# EAGLE design PCB-BOTTOM_FINAL (EAGLE 7.6.0)
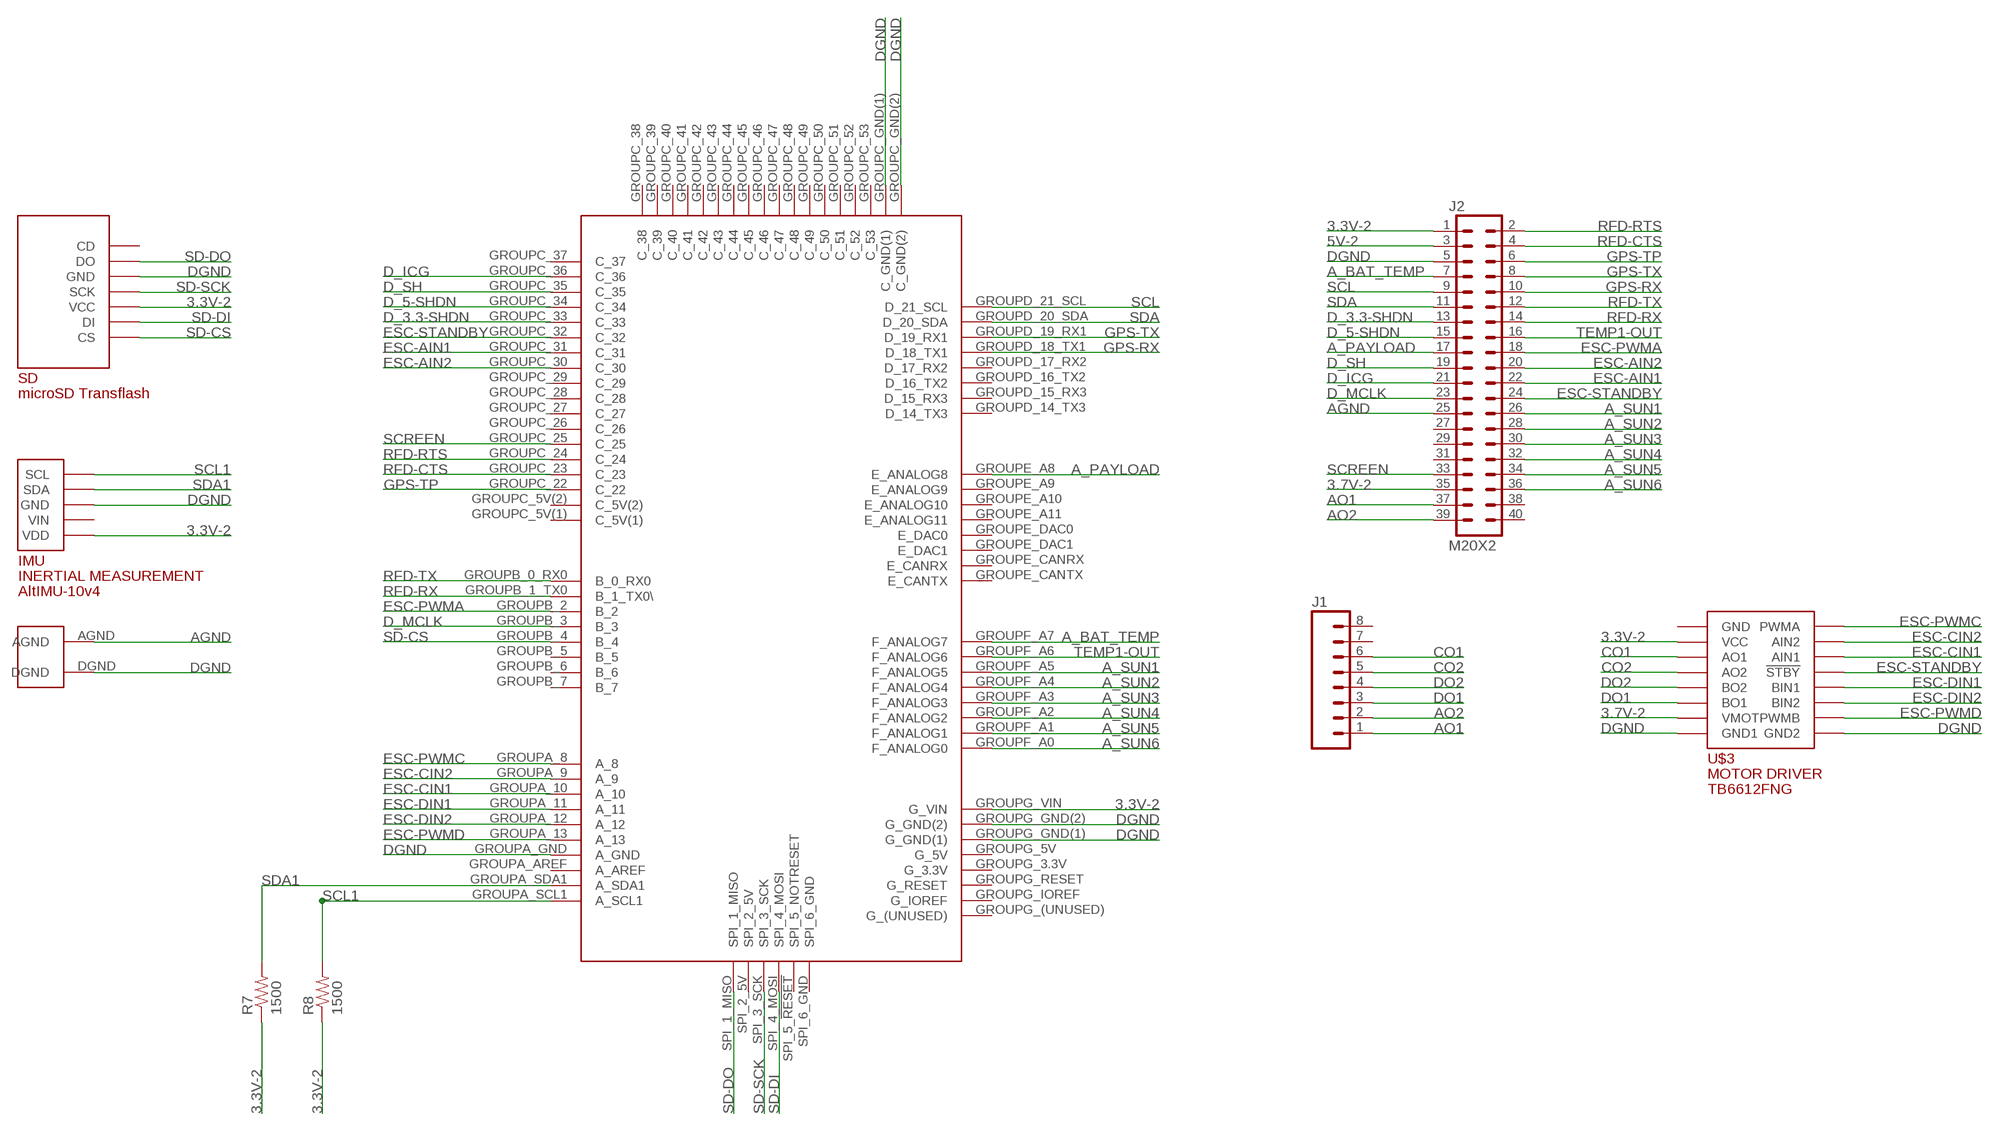
[diagram p0: schematic, sheet 1]

## Parts
IMU  ALTIMU-10V4DIP5  [DIP5]
J1  M08  [1X08_ROUND]
J2  M20X2  [2X20]
R7  1500  R-US_0204/5  [0204/5]
R8  1500  R-US_0204/5  [0204/5]
SD  DIP7DIP7  [DIP7]
U$1  IDUINO_DUE_PRO_DEVICE  [ADCH_ARDUINO-DUE-V03]
U$2  GROUNDPLANECONNECTIONS  [GND_PLANE_CONNECTION]
U$3  MOTOR_DRIVER_DEV  [MOTOR_DRIVER]

## Nets
3.3V-2: IMU.VDD J2.1 R7.1 R8.1 SD.VCC U$1.GROUPG_VIN(G_VIN) U$3.VCC
3.7V-2: J2.35 U$3.VMOT
5V-2: J2.3
A_BAT_TEMP: J2.7 U$1.GROUPF_A7(F_ANALOG7)
A_PAYLOAD: J2.17 U$1.GROUPE_A8(E_ANALOG8)
A_SUN1: J2.26 U$1.GROUPF_A5(F_ANALOG5)
A_SUN2: J2.28 U$1.GROUPF_A4(F_ANALOG4)
A_SUN3: J2.30 U$1.GROUPF_A3(F_ANALOG3)
A_SUN4: J2.32 U$1.GROUPF_A2(F_ANALOG2)
A_SUN5: J2.34 U$1.GROUPF_A1(F_ANALOG1)
A_SUN6: J2.36 U$1.GROUPF_A0(F_ANALOG0)
AGND: J2.25 U$2.AGND
AO1: J1.1 J2.37
AO2: J1.2 J2.39
CO1: J1.6 U$3.AO1
CO2: J1.5 U$3.AO2
D_3.3-SHDN: J2.13 U$1.GROUPC_33(C_33)
D_5-SHDN: J2.15 U$1.GROUPC_34(C_34)
D_ICG: J2.21 U$1.GROUPC_36(C_36)
D_MCLK: J2.23 U$1.GROUPB_3(B_3)
D_SH: J2.19 U$1.GROUPC_35(C_35)
DGND: IMU.GND J2.5 SD.GND U$1.GROUPA_GND(A_GND) U$1.GROUPC_GND(1)(C_GND(1)) U$1.GROUPC_GND(2)(C_GND(2)) U$1.GROUPG_GND(1)(G_GND(1)) U$1.GROUPG_GND(2)(G_GND(2)) U$2.DGND U$3.GND1 U$3.GND2
DO1: J1.3 U$3.BO1
DO2: J1.4 U$3.BO2
ESC-AIN1: J2.22 U$1.GROUPC_31(C_31)
ESC-AIN2: J2.20 U$1.GROUPC_30(C_30)
ESC-CIN1: U$1.GROUPA_10(A_10) U$3.AIN1
ESC-CIN2: U$1.GROUPA_9(A_9) U$3.AIN2
ESC-DIN1: U$1.GROUPA_11(A_11) U$3.BIN1
ESC-DIN2: U$1.GROUPA_12(A_12) U$3.BIN2
ESC-PWMA: J2.18 U$1.GROUPB_2(B_2)
ESC-PWMC: U$1.GROUPA_8(A_8) U$3.PWMA
ESC-PWMD: U$1.GROUPA_13(A_13) U$3.PWMB
ESC-STANDBY: J2.24 U$1.GROUPC_32(C_32) U$3.!STBY
GPS-RX: J2.10 U$1.GROUPD_18_TX1(D_18_TX1)
GPS-TP: J2.6 U$1.GROUPC_22(C_22)
GPS-TX: J2.8 U$1.GROUPD_19_RX1(D_19_RX1)
RFD-CTS: J2.4 U$1.GROUPC_23(C_23)
RFD-RTS: J2.2 U$1.GROUPC_24(C_24)
RFD-RX: J2.14 U$1.GROUPB_1_TX0(B_1_TX0\)
RFD-TX: J2.12 U$1.GROUPB_0_RX0(B_0_RX0)
SCL: J2.9 U$1.GROUPD_21_SCL(D_21_SCL)
SCL1: IMU.SCL R8.2 U$1.GROUPA_SCL1(A_SCL1)
SCREEN: J2.33 U$1.GROUPC_25(C_25)
SD-CS: SD.CS U$1.GROUPB_4(B_4)
SD-DI: SD.DI U$1.SPI_4_MOSI
SD-DO: SD.DO U$1.SPI_1_MISO
SD-SCK: SD.SCK U$1.SPI_3_SCK
SDA: J2.11 U$1.GROUPD_20_SDA(D_20_SDA)
SDA1: IMU.SDA R7.2 U$1.GROUPA_SDA1(A_SDA1)
TEMP1-OUT: J2.16 U$1.GROUPF_A6(F_ANALOG6)
Unconnected: IMU.VIN J1.7 J1.8 J2.27 J2.29 J2.31 J2.38 J2.40 SD.CD U$1.GROUPA_AREF(A_AREF) U$1.GROUPB_5(B_5) U$1.GROUPB_6(B_6) U$1.GROUPB_7(B_7) U$1.GROUPC_5V(1)(C_5V(1)) U$1.GROUPC_5V(2)(C_5V(2)) U$1.GROUPC_26(C_26) U$1.GROUPC_27(C_27) U$1.GROUPC_28(C_28) U$1.GROUPC_29(C_29) U$1.GROUPC_37(C_37) U$1.GROUPC_38(C_38) U$1.GROUPC_39(C_39) U$1.GROUPC_40(C_40) U$1.GROUPC_41(C_41) U$1.GROUPC_42(C_42) U$1.GROUPC_43(C_43) U$1.GROUPC_44(C_44) U$1.GROUPC_45(C_45) U$1.GROUPC_46(C_46) U$1.GROUPC_47(C_47) U$1.GROUPC_48(C_48) U$1.GROUPC_49(C_49) U$1.GROUPC_50(C_50) U$1.GROUPC_51(C_51) U$1.GROUPC_52(C_52) U$1.GROUPC_53(C_53) U$1.GROUPD_14_TX3(D_14_TX3) U$1.GROUPD_15_RX3(D_15_RX3) U$1.GROUPD_16_TX2(D_16_TX2) U$1.GROUPD_17_RX2(D_17_RX2) U$1.GROUPE_A9(E_ANALOG9) U$1.GROUPE_A10(E_ANALOG10) U$1.GROUPE_A11(E_ANALOG11) U$1.GROUPE_CANRX(E_CANRX) U$1.GROUPE_CANTX(E_CANTX) U$1.GROUPE_DAC0(E_DAC0) U$1.GROUPE_DAC1(E_DAC1) U$1.GROUPG_3.3V(G_3.3V) U$1.GROUPG_5V(G_5V) U$1.GROUPG_(UNUSED)(G_(UNUSED)) U$1.GROUPG_IOREF(G_IOREF) U$1.GROUPG_RESET(G_RESET) U$1.SPI_2_5V U$1.SPI_5_!RESET(SPI_5_NOTRESET) U$1.SPI_6_GND U$3.GND

## Library data of the parts
IMU = AltIMU-10v4:ALTIMU-10V4
J1 = SparkFun-Connectors:M08: Header 8 Standard 8-pin 0.1" header. Use with straight break away headers (SKU : PRT-00116), right angle break away headers (PRT-00553), swiss pins (PRT-00743), machine pins (PRT-00117), and female headers (PRT-00115).; PROD_ID: CONN-08437
J2 = SparkFun-Connectors:M20X2: 0.1" spaced headers
R7 R8 = resistor:R-US_: RESISTOR, American symbol
SD = microSD_Transflash:DIP7
U$1 = Iduino_DUE_Pro:IDUINO_DUE_PRO_DEVICE
U$2 = TOP_Groundplaneconnection:GROUNDPLANECONNECTIONS
U$3 = Motor_Driver_TB6612FNG:MOTOR_DRIVER_DEV

## Board
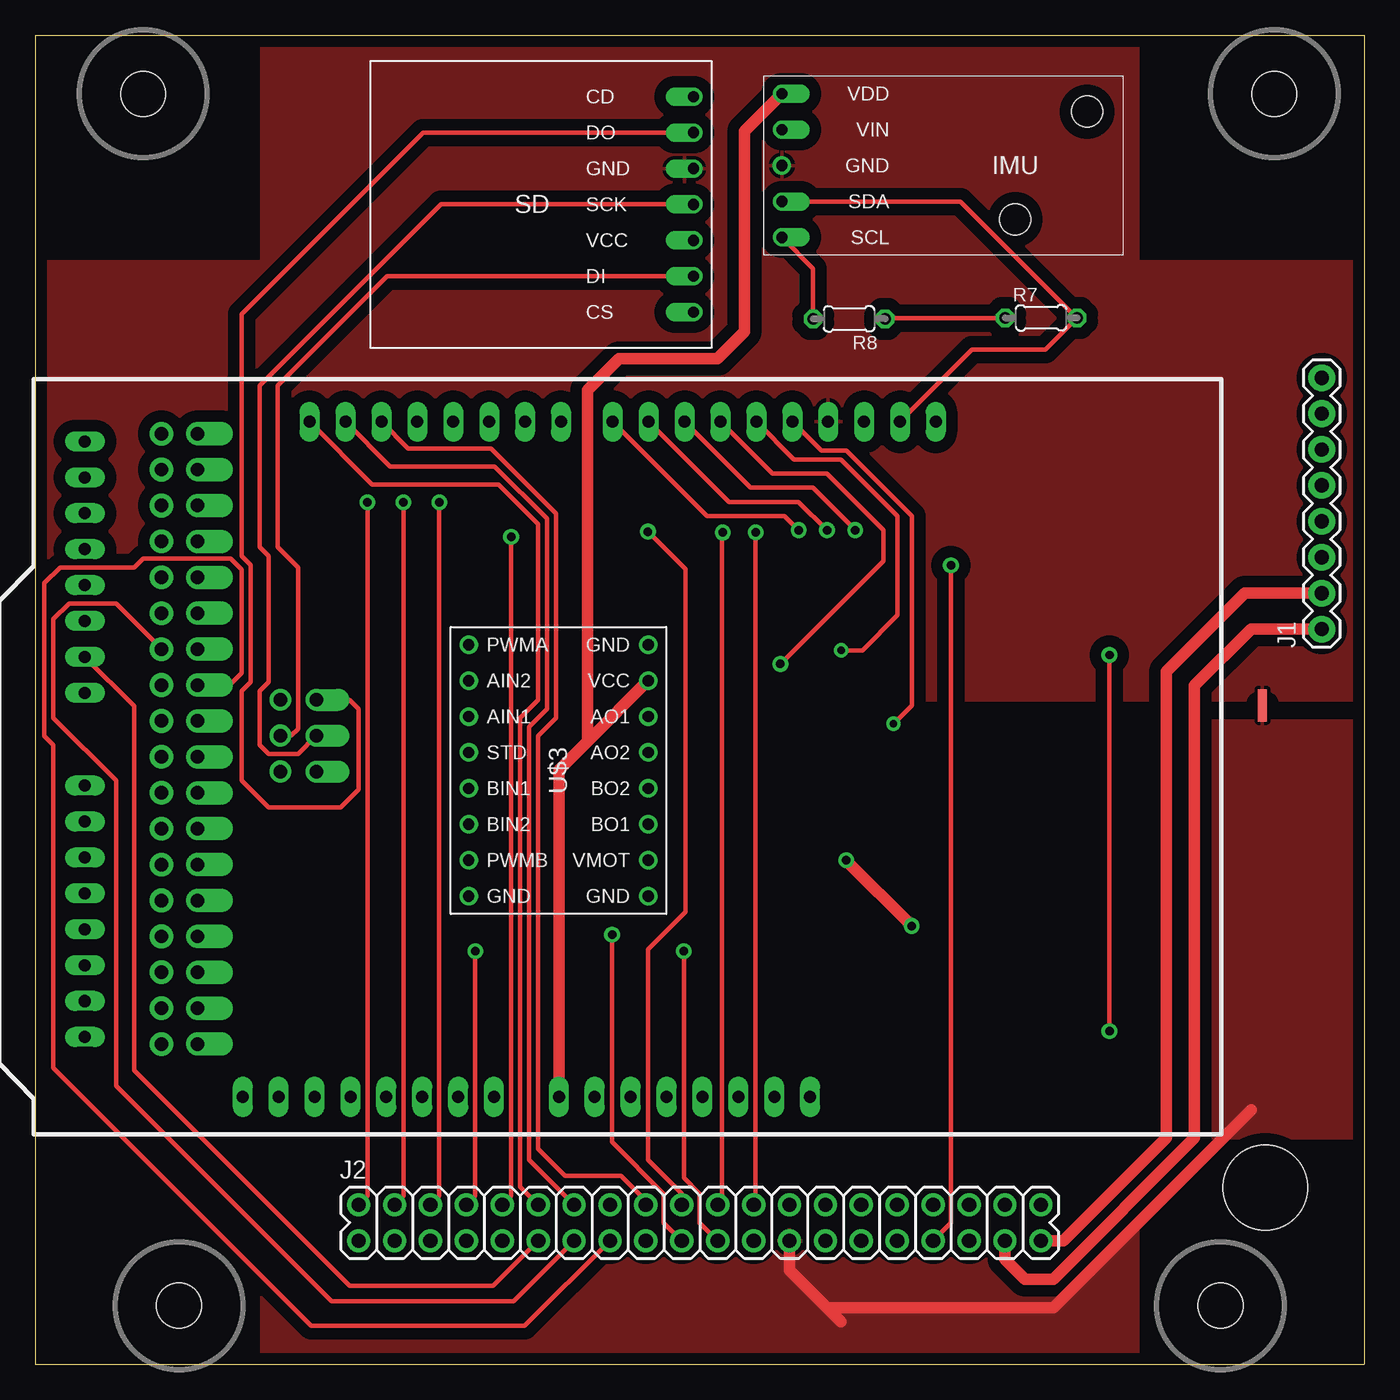
[diagram p1: board, top side]
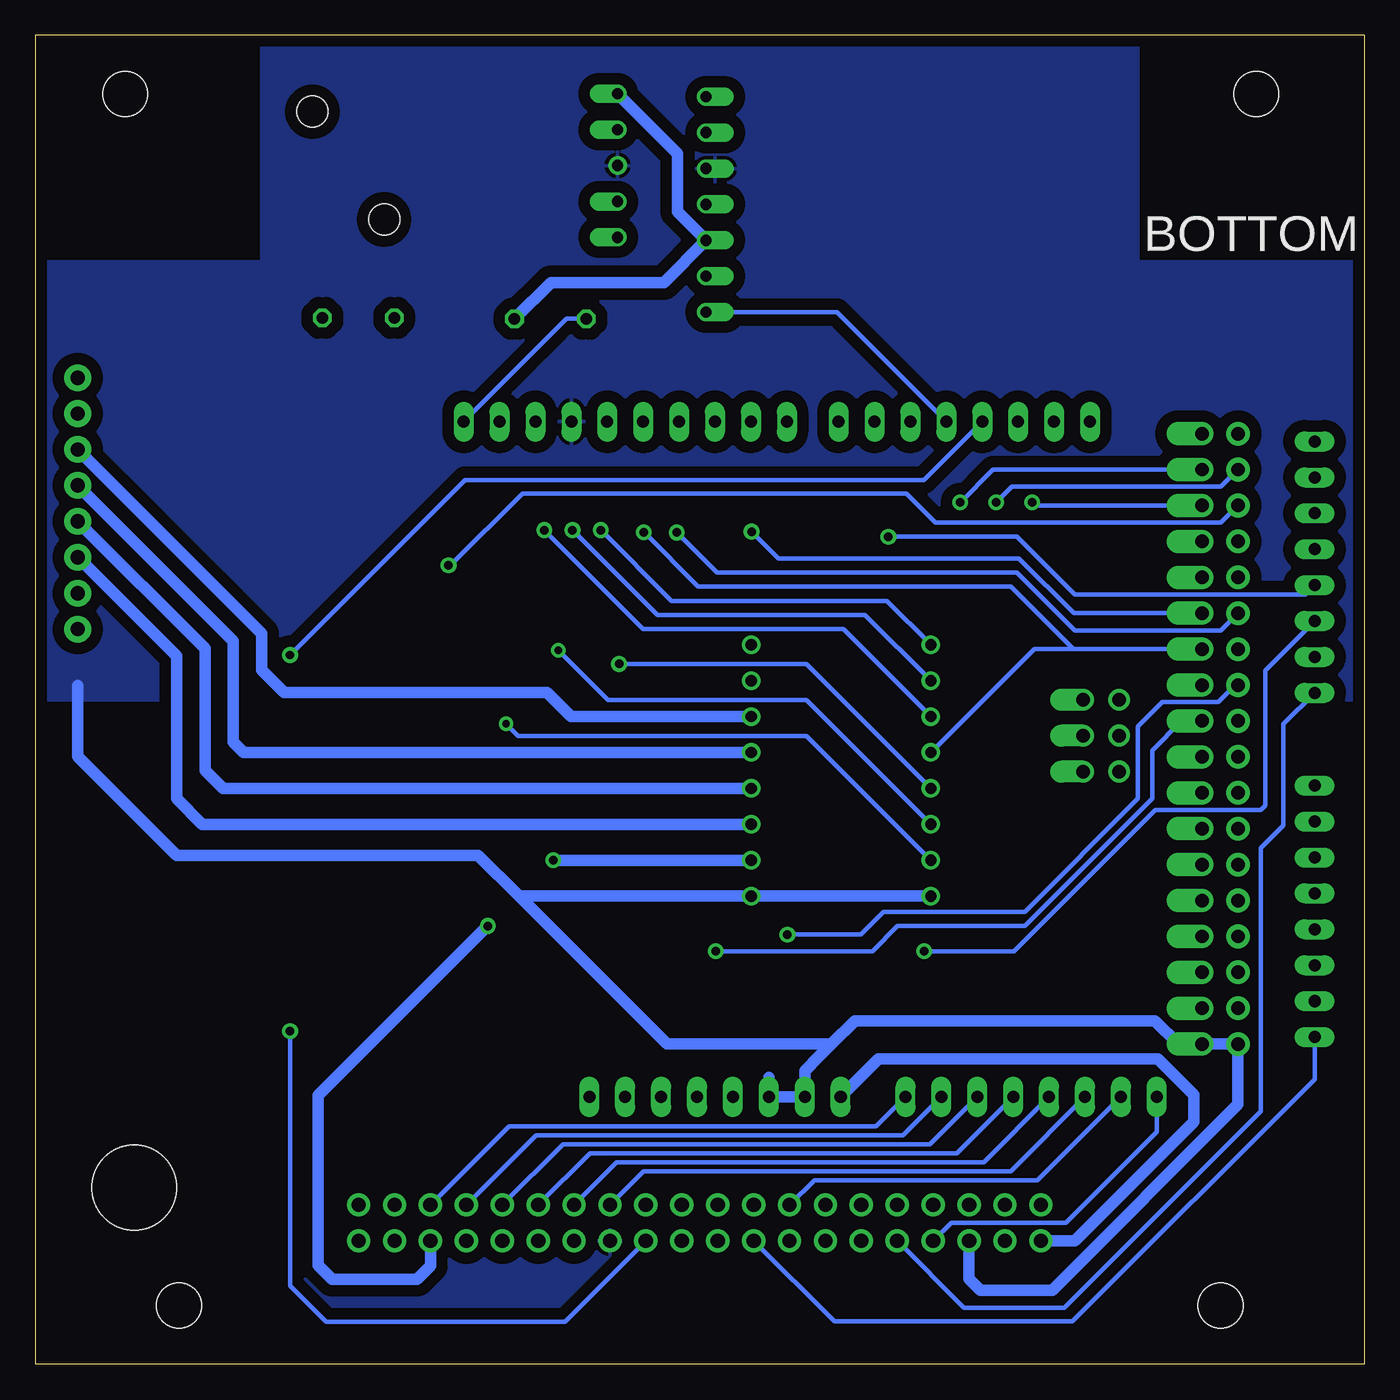
[diagram p2: board, bottom side, seen from below]

Size 94 x 94 mm. Coordinates in mm from the lower left corner, seen from the top.
Outline: 0,0 94,0 94,94 0,94 0,0
Copper layers (1*16): Top 0.035mm / dielectric 1.5mm / Bottom 0.035mm
Design rules "SparkFun-2-layer-STANDARD": minimum track width 10mil, minimum drill 20mil, track to track 10mil, track to pad 8mil, pad to pad 8mil, via to via 10mil, smd to smd 8mil, copper to edge 8mil, drill to drill 8mil, minimum pad ring 10mil, minimum via ring 10mil, stop-mask expansion 4mil, vias tented up to drill 25mil, thermal gap 10mil
Holes 3.18 mm at 7.63,89.86 87.64,89.86 83.83,4.13 10.17,4.13
Holes 6 mm at 87,12.5

### Footprints (pad centres in the part's own frame; a part is rotated, then mirrored left to right if it is on the bottom)
DIP5 = drill 0.8: GND 11.43,0 | drill 0.8 offset: SCL 11.43,5.08; SDA 11.43,2.54; VDD 11.43,-5.08; VIN 11.43,-2.54 | hole 2.2: -5.08,3.81; -10.16,-3.81
1X08_ROUND = drill 1.016 pad 1.88: 1 0,0; 2 2.54,0; 3 5.08,0; 4 7.62,0; 5 10.16,0; 6 12.7,0; 7 15.24,0; 8 17.78,0
2X20 = drill 1.016 pad 1.651: 1 -24.13,-1.27; 2 -24.13,1.27; 3 -21.59,-1.27; 4 -21.59,1.27; 5 -19.05,-1.27; 6 -19.05,1.27; 7 -16.51,-1.27; 8 -16.51,1.27; 9 -13.97,-1.27; 10 -13.97,1.27; 11 -11.43,-1.27; 12 -11.43,1.27; 13 -8.89,-1.27; 14 -8.89,1.27; 15 -6.35,-1.27; 16 -6.35,1.27; 17 -3.81,-1.27; 18 -3.81,1.27; 19 -1.27,-1.27; 20 -1.27,1.27; 21 1.27,-1.27; 22 1.27,1.27; 23 3.81,-1.27; 24 3.81,1.27; 25 6.35,-1.27; 26 6.35,1.27; 27 8.89,-1.27; 28 8.89,1.27; 29 11.43,-1.27; 30 11.43,1.27; 31 13.97,-1.27; 32 13.97,1.27; 33 16.51,-1.27; 34 16.51,1.27; 35 19.05,-1.27; 36 19.05,1.27; 37 21.59,-1.27; 38 21.59,1.27; 39 24.13,-1.27; 40 24.13,1.27
0204/5 = drill 0.813 octagon: 1 -2.54,0; 2 2.54,0
DIP7 = drill 0.8 offset: CD 0,0; CS 0,-15.24; DI 0,-12.7; DO 0,-2.54; GND 0,-5.08; SCK 0,-7.62; VCC 0,-10.16
ADCH_ARDUINO-DUE-V03 = drill 0.85 pad 1.422 long: GROUPA_8 43.344,50.3; GROUPA_9 45.884,50.3; GROUPA_10 48.424,50.3; GROUPA_11 50.964,50.3; GROUPA_12 53.504,50.3; GROUPA_13 56.044,50.3; GROUPA_AREF 61.124,50.3; GROUPA_GND 58.584,50.3; GROUPA_SCL1 66.204,50.3; GROUPA_SDA1 63.664,50.3; GROUPB_0_RX0 21.9,50.3; GROUPB_1_TX0 24.44,50.3; GROUPB_2 26.98,50.3; GROUPB_3 29.52,50.3; GROUPB_4 32.06,50.3; GROUPB_5 34.6,50.3; GROUPB_6 37.14,50.3; GROUPB_7 39.68,50.3; GROUPD_14_TX3 6,48.9; GROUPD_15_RX3 6,46.36; GROUPD_16_TX2 6,43.82; GROUPD_17_RX2 6,41.28; GROUPD_18_TX1 6,38.74; GROUPD_19_RX1 6,36.2; GROUPD_20_SDA 6,33.66; GROUPD_21_SCL 6,31.12; GROUPE_A8 6,6.77; GROUPE_A9 6,9.31; GROUPE_A10 6,11.85; GROUPE_A11 6,14.39; GROUPE_CANRX 6,22.01; GROUPE_CANTX 6,24.55; GROUPE_DAC0 6,16.93; GROUPE_DAC1 6,19.47; GROUPF_A0 34.95,2.54; GROUPF_A1 32.41,2.54; GROUPF_A2 29.87,2.54; GROUPF_A3 27.33,2.54; GROUPF_A4 24.79,2.54; GROUPF_A5 22.25,2.54; GROUPF_A6 19.71,2.54; GROUPF_A7 17.17,2.54; GROUPG_3.3V 49.69,2.54; GROUPG_5V 47.15,2.54; GROUPG_(UNUSED) 57.31,2.54; GROUPG_GND(1) 44.61,2.54; GROUPG_GND(2) 42.07,2.54; GROUPG_IOREF 54.77,2.54; GROUPG_RESET 52.23,2.54; GROUPG_VIN 39.53,2.54 | drill 0.95 pad 1.676 offset: GROUPC_5V(1) 13.97,49.45; GROUPC_22 13.97,46.91; GROUPC_24 13.97,44.37; GROUPC_26 13.97,41.83; GROUPC_28 13.97,39.29; GROUPC_30 13.97,36.75; GROUPC_32 13.97,34.21; GROUPC_34 13.97,31.67; GROUPC_36 13.97,29.13; GROUPC_38 13.97,26.59; GROUPC_40 13.97,24.05; GROUPC_42 13.97,21.51; GROUPC_44 13.97,18.97; GROUPC_46 13.97,16.43; GROUPC_48 13.97,13.89; GROUPC_50 13.97,11.35; GROUPC_52 13.97,8.81; GROUPC_GND(1) 13.97,6.27 | drill 0.95 pad 1.676: GROUPC_5V(2) 11.43,49.45; GROUPC_23 11.43,46.91; GROUPC_25 11.43,44.37; GROUPC_27 11.43,41.83; GROUPC_29 11.43,39.29; GROUPC_31 11.43,36.75; GROUPC_33 11.43,34.21; GROUPC_35 11.43,31.67; GROUPC_37 11.43,29.13; GROUPC_39 11.43,26.59; GROUPC_41 11.43,24.05; GROUPC_43 11.43,21.51; GROUPC_45 11.43,18.97; GROUPC_47 11.43,16.43; GROUPC_49 11.43,13.89; GROUPC_51 11.43,11.35; GROUPC_53 11.43,8.81; GROUPC_GND(2) 11.43,6.27 | drill 0.95 pad 1.55 offset: SPI_1_MISO 22.373,30.63; SPI_3_SCK 22.373,28.09; SPI_5_!RESET 22.373,25.55 | drill 0.95 pad 1.55: SPI_2_5V 19.833,30.63; SPI_4_MOSI 19.833,28.09; SPI_6_GND 19.833,25.55
GND_PLANE_CONNECTION = smd 1.27 x 0.635: AGND -1,0; DGND 0,0
MOTOR_DRIVER = drill 0.8: !STBY -6.35,1.27; AIN1 -6.35,3.81; AIN2 -6.35,6.35; AO1 6.35,3.81; AO2 6.35,1.27; BIN1 -6.35,-1.27; BIN2 -6.35,-3.81; BO1 6.35,-3.81; BO2 6.35,-1.27; GND 6.35,8.89; GND1 6.35,-8.89; GND2 -6.35,-8.89; PWMA -6.35,8.89; PWMB -6.35,-6.35; VCC 6.35,6.35; VMOT 6.35,-6.35

### Placement (x,y rotation side)
IMU  64.24,84.79 180 top
J1  91,52 90 top
J2  47,10 0 top
R7  71.15,74.01 0 top
R8  57.56,73.94 180 top
SD  46.56,89.66 0 top
U$1  -2.5,16.37 0 top
U$2  86.8,47.1 90 top
U$3  37,42 0 top

### Tracks (layer width: path | path; a pad name or v marks a point on that pad's centre or on a via)
3.3V-2
  Top 0.305: R7.1 60.17,74.01 R8.1
  Top 0.813: U$1.GROUPG_VIN 37.03,42.03 39.05,44.05 | IMU.VDD 50.16,87.22 50.16,73.03 48.26,71.12 41.27,71.12 39.05,68.9 39.05,44.05 | U$3.VCC 39.05,44.05
  Bottom 0.813: R8.1 57.53,76.52 49.54,76.52 SD.VCC 48.58,81.52 48.58,85.64 IMU.VDD | J2.1 20.48,8.73 12.06,17.14 12.06,19.05 14.61,21.59 34.35,21.59 U$1.GROUPG_VIN
3.7V-2  (via drill 0.6)
  Top 0.813: v62,31 v57.35,35.65
  Bottom 0.813: J2.35 66.05,6.95 67,6 73,6 74,7 74,19 v62,31 | v57.35,35.65 U$3.VMOT
A_BAT_TEMP
  Bottom 0.305: J2.7 29.21,10.01 21.11,10.01 14.67,16.45 U$1.GROUPF_A7
A_PAYLOAD
  Bottom 0.305: J2.17 37.48,3.02 20.64,3.02 3.5,20.15 U$1.GROUPE_A8
A_SUN1
  Bottom 0.305: J2.26 50.97,13.65 25.01,13.65 U$1.GROUPF_A5
A_SUN2
  Bottom 0.305: J2.28 52.87,14.29 26.91,14.29 U$1.GROUPF_A4
A_SUN3
  Bottom 0.305: J2.30 54.78,14.92 28.82,14.92 U$1.GROUPF_A3
A_SUN4
  Bottom 0.305: J2.32 56.68,15.56 30.72,15.56 U$1.GROUPF_A2
A_SUN5
  Bottom 0.305: J2.34 58.59,16.19 32.63,16.19 U$1.GROUPF_A1
A_SUN6
  Bottom 0.305: J2.36 60.49,16.83 34.53,16.83 U$1.GROUPF_A0
AGND
  Top 0.813: 56,4 57,3 | J2.25 53.35,6.65 56,4 | 56,4 72,4 86,18
  pour Bottom (isolate 0.813): 0,45.5 0,16 16,16 16,0 78,0 78,16 94,16 94,45.5
  pour Top (isolate 0.813): 94,45.5 94,16 78,16 78,0 16,0 16,16 0,16 0,45.5
AO1
  Top 0.813: J2.37 68.59,7.41 70,6 72,6 82,16 82,48 86,52 J1.1
AO2
  Top 0.813: J2.39 72.73,8.73 80,16 80,49 85.54,54.54 J1.2
CO1
  Bottom 0.813: J1.6 78,51.7 78,49.1 76.4,47.5 57.8,47.5 56.11,45.81 U$3.AO1
CO2
  Bottom 0.813: U$3.AO2 79.27,43.27 80,44 80,51.16 J1.5
D_3.3-SHDN
  Top 0.305: U$1.GROUPC_33 8.93,50.6 5.71,53.82 2.38,53.82 1.27,52.7 1.27,45.72 5.71,41.27 5.71,19.68 20.95,4.45 33.83,4.45 J2.13
D_5-SHDN
  Top 0.305: J2.15 34.62,2.7 20.32,2.7 19.68,2.7 19.53,2.7 1.27,20.95 1.27,43.81 0.64,44.45 0.64,55.24 1.75,56.36 6.99,56.36 7.62,56.99 13.81,56.99 14.61,56.2 14.61,48.9 13.75,48.04 U$1.GROUPC_34
D_ICG  (via drill 0.6)
  Top 0.305: J2.21 46.99,10.01 46.99,12.06 45.88,13.18 v45.88,29.21
  Bottom 0.305: U$1.GROUPC_36 12.92,45.5 15,43.42 15,40 24,31 33,31 34.79,29.21 v45.88,29.21
D_MCLK  (via drill 0.6)
  Top 0.305: v75.98,50.16 v75.98,23.56
  Bottom 0.305: J2.23 56.54,3 73.42,3 75.98,5.56 v75.98,23.56 | U$1.GROUPB_3 31.14,62.55 63.59,62.55 v75.98,50.16
D_SH  (via drill 0.6)
  Top 0.305: J2.19 44.45,10.01 44.45,12.06 40.8,15.72 v40.8,30.39
  Bottom 0.305: U$1.GROUPC_35 9.11,48.04 10.32,46.83 14.29,46.83 16,45.12 16,40 24,32 34,32 35.61,30.39 v40.8,30.39
DGND
  Bottom 0.813: J2.5 27.95,6.04 27.15,5.24 22.07,5.24 8.93,18.38 U$1.GROUPC_GND(2) U$1.GROUPC_GND(1) 13.14,22.64 14.8,24.3 36.02,24.3 37.69,22.64 | 42.11,20.3 U$1.GROUPG_GND(1) U$1.GROUPG_GND(2) 39.57,20.75 38.56,21.76 37.69,22.64 | 37.69,22.64 49.31,22.64 59.78,33.11 | U$3.GND2 U$3.GND1 59.78,33.11 | 59.78,33.11 62.67,36 84,36 91,43 91,48
  pour Bottom (isolate 0.813): 0,78 16,78 16,94 78,94 78,78 94,78 94,47 0,47
  pour Top (isolate 0.813): 0,78 16,78 16,94 78,94 78,78 94,78 94,47 0,47
DO1
  Bottom 0.813: U$3.BO1 82.19,38.19 84,40 84,50.08 J1.3
DO2
  Bottom 0.813: U$3.BO2 80.73,40.73 82,42 82,50.62 J1.4
ESC-AIN1  (via drill 0.6)
  Top 0.305: J2.22 48.58,11.58 48.58,58.78 v48.62,58.83
  Bottom 0.305: U$1.GROUPC_31 10.14,51.91 20.48,51.91 24.57,56 45.79,56 v48.62,58.83
ESC-AIN2  (via drill 0.6)
  Top 0.305: J2.20 45.73,12.05 43.34,14.45 43.34,29.34 46,32 46,56.23 v43.34,58.9
  Bottom 0.305: U$1.GROUPC_30 20.54,53.12 24.42,57 41.44,57 v43.34,58.9
ESC-CIN1  (via drill 0.6)
  Top 0.305: v58,59 55,62 50.59,62 U$1.GROUPA_10
  Bottom 0.305: U$3.AIN1 36.84,52 51,52 v58,59
ESC-CIN2  (via drill 0.6)
  Top 0.305: v56,59 54,61 49.05,61 U$1.GROUPA_9
  Bottom 0.305: U$3.AIN2 35.3,53 50,53 v56,59
ESC-DIN1  (via drill 0.6)
  Top 0.305: v52.7,49.53 60,56.83 60,59 56,63 52.13,63 U$1.GROUPA_11
  Bottom 0.305: U$3.BIN1 39.45,49.53 v52.7,49.53
ESC-DIN2  (via drill 0.51)
  Top 0.305: U$1.GROUPA_12 53.67,64 57,64 61,60 61,53 58.5,50.5 v57,50.5
  Bottom 0.305: U$3.BIN2 39.46,47 53.5,47 v57,50.5
ESC-PWMA
  Top 0.305: J2.18 43.34,11.42 41.42,13.34 37.47,13.34 35.56,15.24 35.56,44.45 36.83,45.72 36.83,57 36.83,57.15 36.83,60.17 32.23,64.77 26.38,64.77 U$1.GROUPB_2
ESC-PWMC  (via drill 0.6)
  Top 0.305: v54,59 53,60 47.51,60 U$1.GROUPA_8
  Bottom 0.305: U$3.PWMA 33.76,54 49,54 v54,59
ESC-PWMD  (via drill 0.51)
  Top 0.305: U$1.GROUPA_13 55.6,64.61 57.39,64.61 62,60 62,46.6 v60.7,45.3
  Bottom 0.305: U$3.PWMB 39.45,44.45 59.85,44.45 v60.7,45.3
ESC-STANDBY  (via drill 0.6)
  Top 0.305: v50.96,58.85 50.96,11.42 J2.24
  Bottom 0.305: 20.58,50.58 U$1.GROUPC_32 | 20.58,50.58 25,55 47.11,55 v50.96,58.85 | 20.58,50.58 23.34,50.58 U$3.!STBY
GPS-RX  (via drill 0.6)
  Top 0.305: v33.66,58.53 33.66,11.89 J2.10
  Bottom 0.305: U$1.GROUPD_18_TX1 4.16,54.45 20.48,54.45 24.56,58.53 v33.66,58.53
GPS-TP  (via drill 0.6)
  Top 0.305: 28.26,11.58 J2.6 28.57,11.89 v28.57,60.96
  Bottom 0.305: U$1.GROUPC_22 26.25,63.28 v28.57,60.96
GPS-TX  (via drill 0.6)
  Top 0.305: v31.11,29.21 31.11,11.89 J2.8
  Bottom 0.305: U$1.GROUPD_19_RX1 6.99,49.09 6.99,39.53 7.3,39.21 14.76,39.21 24.77,29.21 v31.11,29.21
RFD-CTS  (via drill 0.6)
  Top 0.305: J2.4 26.04,11.89 v26.04,60.96
  Bottom 0.305: U$1.GROUPC_23 10.14,62.07 24.92,62.07 v26.04,60.96
RFD-RTS  (via drill 0.6)
  Top 0.305: J2.2 23.5,11.89 v23.5,60.96
  Bottom 0.305: U$1.GROUPC_24 23.27,60.74 v23.5,60.96
RFD-RX
  Top 0.305: 38.42,11.58 J2.14 34.92,14.46 34.92,45.09 36.2,46.35 36.2,55 36.2,56.52 36.2,59.8 32.5,63.5 25.11,63.5 U$1.GROUPB_1_TX0
RFD-TX
  Top 0.305: 35.88,11.58 J2.12 34.29,12.55 34.29,45.72 35.56,46.99 35.56,54 35.56,55.88 35.56,59.44 32.77,62.23 23.84,62.23 U$1.GROUPB_0_RX0
SCL
  Bottom 0.305: U$1.GROUPD_21_SCL 5.71,45.27 5.71,38.1 7.3,36.51 7.3,17.9 21.2,4 28.3,4 J2.9
SCL1
  Top 0.305: R8.2 55.02,77.5 IMU.SCL
  Bottom 0.305: U$1.GROUPA_SCL1 56.43,73.94 R8.2
SCREEN  (via drill 0.6)
  Top 0.305: v64.77,56.52 64.77,9.99 J2.33
  Bottom 0.305: U$1.GROUPC_25 10.14,59.53 30.32,59.53 32.38,61.59 59.53,61.59 64.61,56.52 v64.77,56.52
SD-CS
  Bottom 0.305: U$1.GROUPB_4 37.31,74.42 SD.CS
SD-DI
  Top 0.305: SD.DI 24.89,76.96 17.14,69.22 17.14,57.78 18.57,56.36 18.57,50.01 18.57,49.53 18.57,44.93 18.11,44.46 U$1.SPI_4_MOSI
SD-DO
  Top 0.305: SD.DO 27.43,87.12 14.61,74.3 14.61,57.15 15.24,56.52 15.24,48.26 14.61,47.62 14.61,41.27 16.51,39.37 21.59,39.37 22.86,40.64 22.86,46.35 22.21,47 U$1.SPI_1_MISO
SD-SCK
  Top 0.305: SD.SCK 28.7,82.04 15.88,69.22 15.88,57.78 16.51,57.15 16.51,48.26 15.88,47.62 15.88,43.81 16.51,43.18 18.59,43.18 U$1.SPI_3_SCK
SDA
  Top 0.305: J2.11 32.4,5.56 22.23,5.56 6.99,20.8 6.99,46.55 U$1.GROUPD_20_SDA
SDA1
  Top 0.305: IMU.SDA 65.45,82.25 R7.2 71.44,71.75 66.25,71.75 U$1.GROUPA_SDA1
TEMP1-OUT
  Bottom 0.305: J2.16 38.9,13.02 23.1,13.02 U$1.GROUPF_A6

### Text on the board
bPlace: BOTTOM